# Altium schematic sheet SAMV71_Xplained_Ultra_TopLevel.SchDoc: Top Level Schematics
size A3; Organization: ATMEL Norway; Address1: Vestre Rosten 79; Address2: N-7075 TILLER; Address3: NORWAY; DocumentNumber: A09-2407; Revision: 11; SheetNumber: 1; SheetTotal: 13; DrawnBy: Microchip Norway; Engineer: AH; PageSetup: Record=PageOptions|CenterHorizontal=True|CenterVertical=True|PrintScale=1.01|XCorrection=1.00|YCorrection=1.00|PrintKind=1|BorderSize=5000000|LeftOffset=0|BottomOffset=0|Orientation=2|PaperLength=1000|PaperWidth=1000|Scale=100|PaperSource=7|PrintQuality=-4|MediaType=1|DitherType=10|PaperKind=Letter|PrintScaleMode=1; ProjectTitle: SAM V71 Xplained Ultra; PCBNumber: A08-2216; PCBRevision: 4
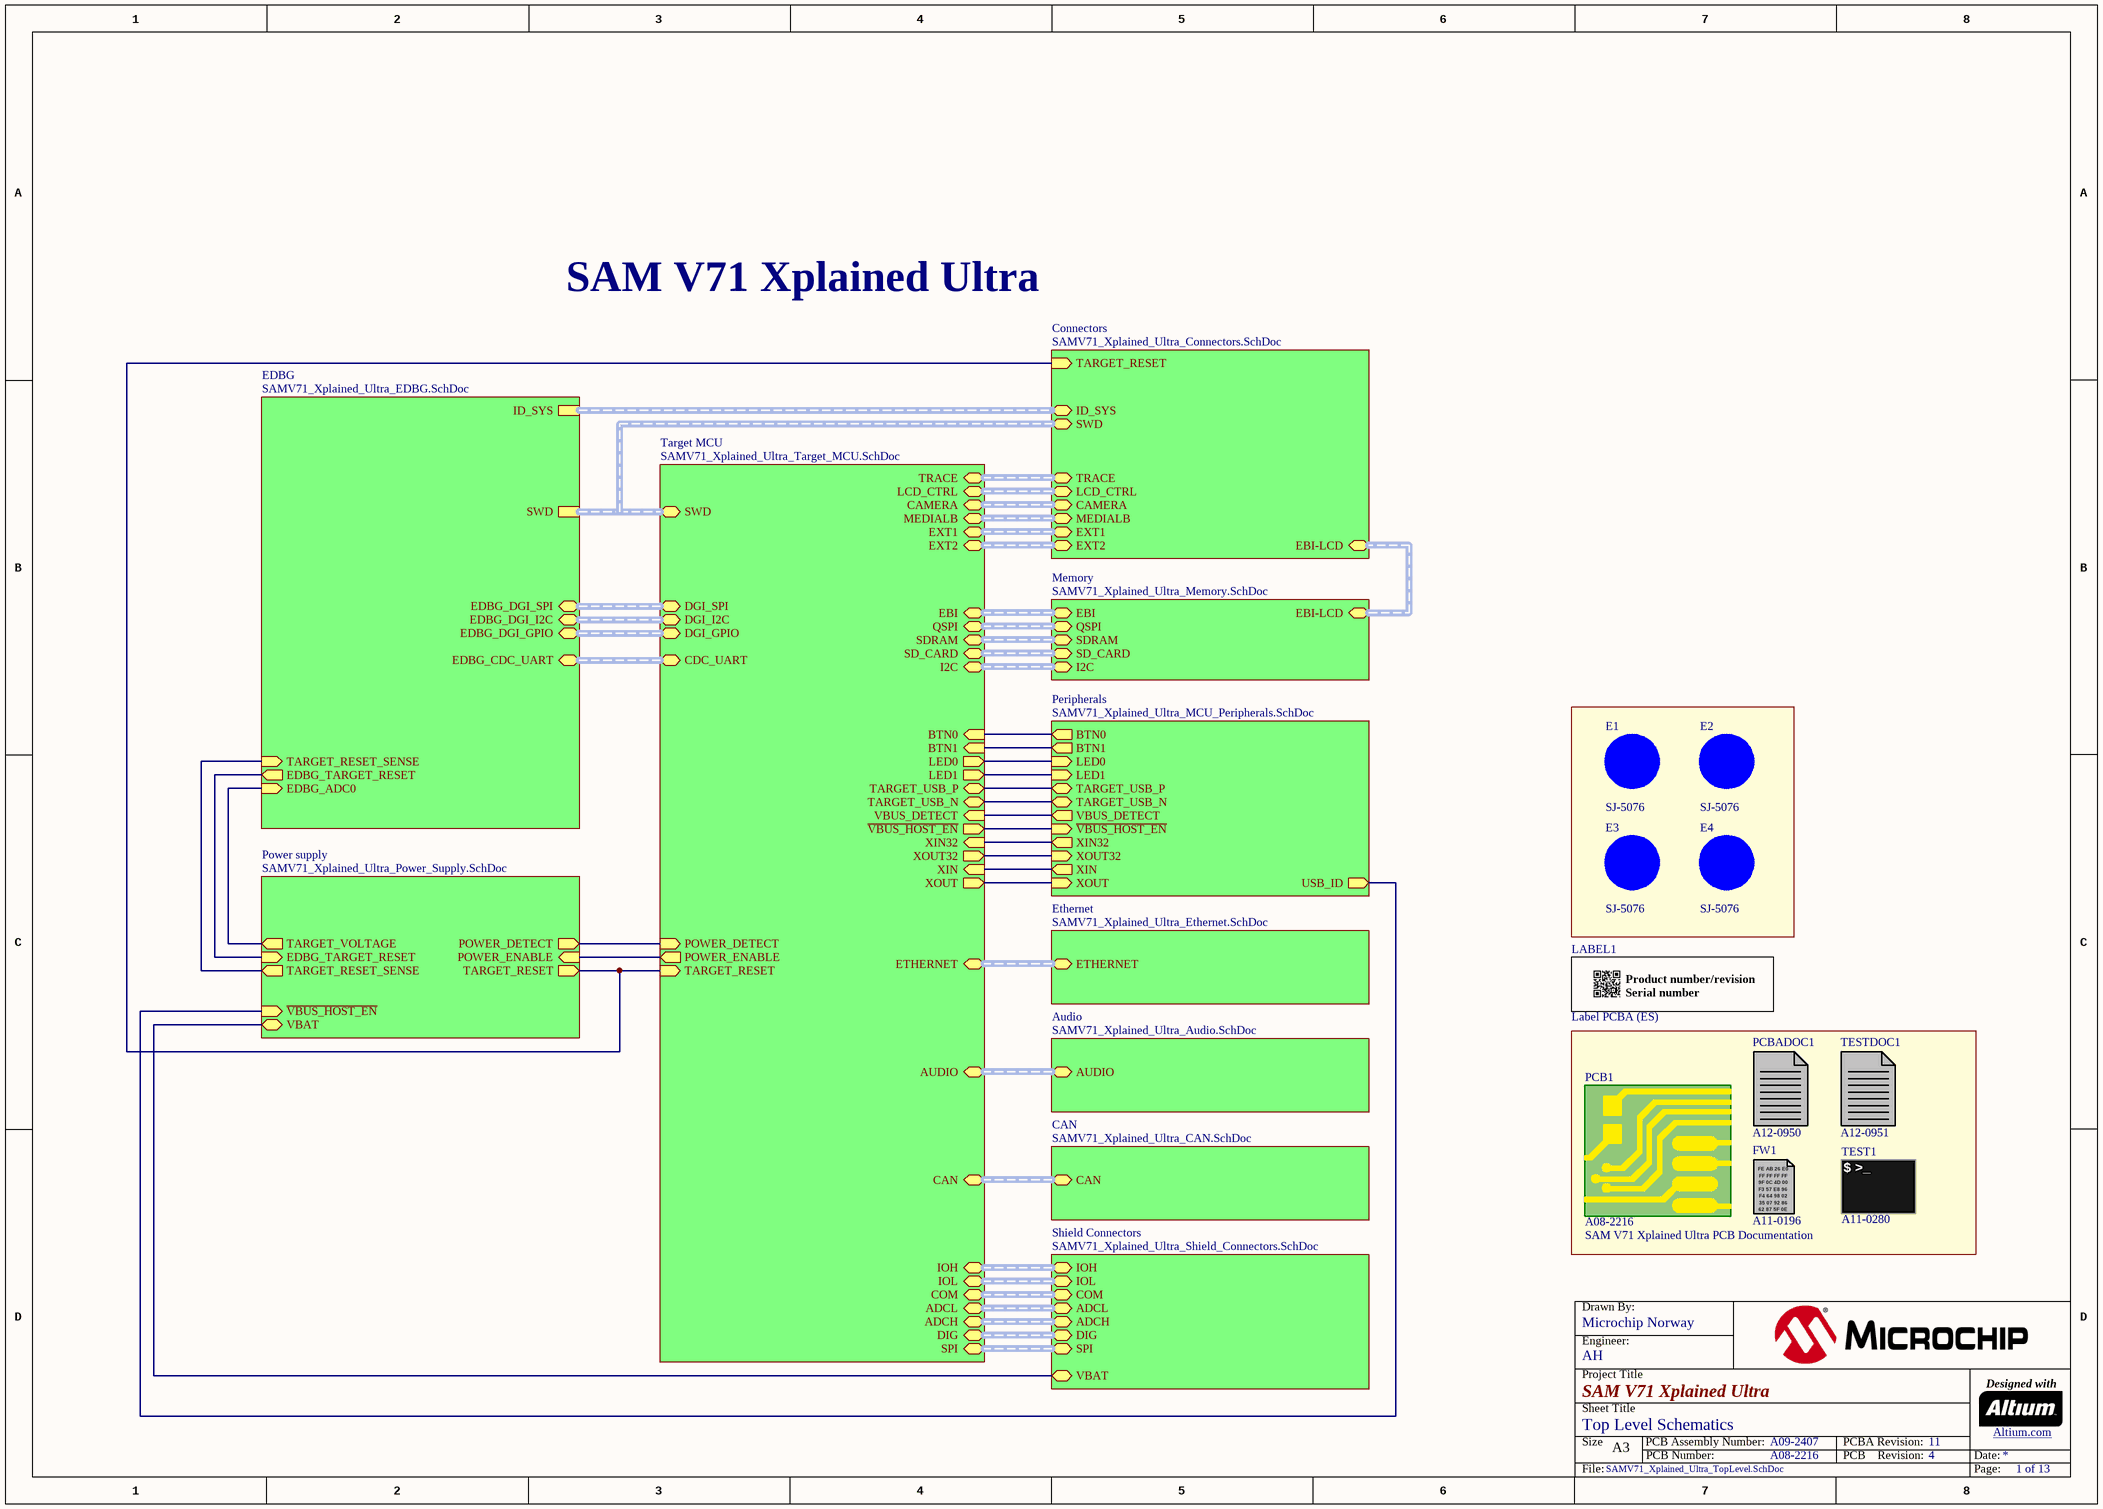
[diagram p0: SAMV71_Xplained_Ultra_TopLevel.SchDoc]

## Parts
E1  value SJ-5076  [AP8-00192]
E2  value SJ-5076  [AP8-00192]
E3  value SJ-5076  [AP8-00192]
E4  value SJ-5076  [AP8-00192]
FW1  AN: A11-0196  (mechanical)
LABEL1  value Label PCBA (ES)  [AP8-00317]
PCB1  value SAM V71 Xplained Ultra PCB Documentation  AN: A08-2216  (mechanical)
PCBADOC1  AN: A12-0950  (mechanical)
TEST1  AN: A11-0280  (mechanical)
TESTDOC1  AN: A12-0951  (mechanical)

## Sub-sheets
Audio = SAMV71_Xplained_Ultra_Audio.SchDoc: AUDIO (harness AUDIO)
CAN = SAMV71_Xplained_Ultra_CAN.SchDoc: CAN (harness CAN)
Connectors = SAMV71_Xplained_Ultra_Connectors.SchDoc: ID_SYS (harness ID_SYS), EXT1 (harness EXT1), EXT2 (harness EXT2), CAMERA (harness CAMERA), MEDIALB (harness MEDIALB), TRACE (harness TRACE), LCD_CTRL (harness LCD_CTRL), SWD (harness SWD), TARGET_RESET (in), EBI-LCD (harness EBI-LCD)
EDBG = SAMV71_Xplained_Ultra_EDBG.SchDoc: ID_SYS (harness ID_SYS), SWD (harness SWD), EDBG_CDC_UART (harness CDC_UART), EDBG_DGI_I2C (harness DGI_I2C), EDBG_DGI_SPI (harness DGI_SPI), EDBG_DGI_GPIO (harness DGI_GPIO), TARGET_RESET_SENSE (in), EDBG_ADC0 (in), EDBG_TARGET_RESET (out)
Ethernet = SAMV71_Xplained_Ultra_Ethernet.SchDoc: ETHERNET (harness ETHERNET)
Memory = SAMV71_Xplained_Ultra_Memory.SchDoc: SD_CARD (harness SD_CARD), EBI (harness EBI), QSPI (harness QSPI), SDRAM (harness SDRAM), I2C (harness I2C), EBI-LCD (harness EBI-LCD)
Peripherals = SAMV71_Xplained_Ultra_MCU_Peripherals.SchDoc: BTN0 (out), BTN1 (out), LED0 (in), TARGET_USB_N (bidir), TARGET_USB_P (bidir), XOUT32 (in), XIN32 (out), XIN (out), XOUT (in), LED1 (in), VBUS_DETECT (out), USB_ID (out), ~{VBUS_HOST_EN} (in)
Power supply = SAMV71_Xplained_Ultra_Power_Supply.SchDoc: TARGET_VOLTAGE (out), ~{VBUS_HOST_EN} (in), EDBG_TARGET_RESET (in), POWER_ENABLE (in), TARGET_RESET (out), POWER_DETECT (out), VBAT (bidir), TARGET_RESET_SENSE (out)
Shield Connectors = SAMV71_Xplained_Ultra_Shield_Connectors.SchDoc: IOH (harness IOH), IOL (harness IOL), COM (harness COM), ADCL (harness ADCL), ADCH (harness ADCH), DIG (harness DIG), SPI (harness SPI), VBAT (bidir)
Target MCU = SAMV71_Xplained_Ultra_Target_MCU.SchDoc: SWD (harness SWD), DGI_SPI (harness DGI_SPI), DGI_I2C (harness DGI_I2C), DGI_GPIO (harness DGI_GPIO), CDC_UART (harness CDC_UART), SD_CARD (harness SD_CARD), QSPI (harness QSPI), SDRAM (harness SDRAM), ETHERNET (harness ETHERNET), EXT2 (harness EXT2), EXT1 (harness EXT1), EBI (harness EBI), CAMERA (harness CAMERA), AUDIO (harness AUDIO), BTN0 (in), BTN1 (in), LED0 (out), TARGET_USB_P (bidir), XOUT32 (out), XIN32 (in), XIN (in), XOUT (out), LED1 (out), TARGET_USB_N (bidir), IOH (harness IOH), IOL (harness IOL), COM (harness COM), ADCL (harness ADCL), ADCH (harness ADCH), DIG (harness DIG), CAN (harness CAN), ~{VBUS_HOST_EN} (out), I2C (harness I2C), TARGET_RESET (in), POWER_ENABLE (out), TRACE (harness TRACE), LCD_CTRL (harness LCD_CTRL), MEDIALB (harness MEDIALB), SPI (harness SPI), POWER_DETECT (in), VBUS_DETECT (in)

## Nets
(unnamed): sheet Target MCU/BTN0, sheet Peripherals/BTN0
(unnamed): sheet Target MCU/BTN1, sheet Peripherals/BTN1
(unnamed): sheet Target MCU/LED0, sheet Peripherals/LED0
(unnamed): sheet Target MCU/TARGET_USB_P, sheet Peripherals/TARGET_USB_P
(unnamed): sheet Target MCU/XOUT32, sheet Peripherals/XOUT32
(unnamed): sheet Target MCU/XIN32, sheet Peripherals/XIN32
(unnamed): sheet Target MCU/XIN, sheet Peripherals/XIN
(unnamed): sheet Target MCU/XOUT, sheet Peripherals/XOUT
(unnamed): sheet Target MCU/LED1, sheet Peripherals/LED1
(unnamed): sheet Target MCU/TARGET_USB_N, sheet Peripherals/TARGET_USB_N
(unnamed): sheet Target MCU/~{VBUS_HOST_EN}, sheet Peripherals/~{VBUS_HOST_EN}
(unnamed): sheet Target MCU/TARGET_RESET, sheet Connectors/TARGET_RESET, sheet Power supply/TARGET_RESET
(unnamed): sheet Target MCU/POWER_ENABLE, sheet Power supply/POWER_ENABLE
(unnamed): sheet Target MCU/POWER_DETECT, sheet Power supply/POWER_DETECT
(unnamed): sheet Target MCU/VBUS_DETECT, sheet Peripherals/VBUS_DETECT
(unnamed): sheet EDBG/TARGET_RESET_SENSE, sheet Power supply/TARGET_RESET_SENSE
(unnamed): sheet EDBG/EDBG_ADC0, sheet Power supply/TARGET_VOLTAGE
(unnamed): sheet EDBG/EDBG_TARGET_RESET, sheet Power supply/EDBG_TARGET_RESET
(unnamed): sheet Power supply/~{VBUS_HOST_EN}, sheet Peripherals/USB_ID
(unnamed): sheet Power supply/VBAT, sheet Shield Connectors/VBAT

Not connected (* = marked no-connect by the designer): E1 1(FIDUCIAL); E2 1(FIDUCIAL); E3 1(FIDUCIAL); E4 1(FIDUCIAL)

## Buses and harness runs
harness sheet Audio/AUDIO = sheet Target MCU/AUDIO
harness sheet CAN/CAN = sheet Target MCU/CAN
harness sheet Connectors/CAMERA = sheet Target MCU/CAMERA
harness sheet Connectors/EBI-LCD = sheet Memory/EBI-LCD
harness sheet Connectors/EXT1 = sheet Target MCU/EXT1
harness sheet Connectors/EXT2 = sheet Target MCU/EXT2
harness sheet Connectors/ID_SYS = sheet EDBG/ID_SYS
harness sheet Connectors/LCD_CTRL = sheet Target MCU/LCD_CTRL
harness sheet Connectors/MEDIALB = sheet Target MCU/MEDIALB
harness sheet Connectors/SWD = sheet EDBG/SWD = sheet Target MCU/SWD
harness sheet Connectors/TRACE = sheet Target MCU/TRACE
harness sheet EDBG/EDBG_CDC_UART = sheet Target MCU/CDC_UART
harness sheet EDBG/EDBG_DGI_GPIO = sheet Target MCU/DGI_GPIO
harness sheet EDBG/EDBG_DGI_I2C = sheet Target MCU/DGI_I2C
harness sheet EDBG/EDBG_DGI_SPI = sheet Target MCU/DGI_SPI
harness sheet Ethernet/ETHERNET = sheet Target MCU/ETHERNET
harness sheet Memory/EBI = sheet Target MCU/EBI
harness sheet Memory/I2C = sheet Target MCU/I2C
harness sheet Memory/QSPI = sheet Target MCU/QSPI
harness sheet Memory/SD_CARD = sheet Target MCU/SD_CARD
harness sheet Memory/SDRAM = sheet Target MCU/SDRAM
harness sheet Shield Connectors/ADCH = sheet Target MCU/ADCH
harness sheet Shield Connectors/ADCL = sheet Target MCU/ADCL
harness sheet Shield Connectors/COM = sheet Target MCU/COM
harness sheet Shield Connectors/DIG = sheet Target MCU/DIG
harness sheet Shield Connectors/IOH = sheet Target MCU/IOH
harness sheet Shield Connectors/IOL = sheet Target MCU/IOL
harness sheet Shield Connectors/SPI = sheet Target MCU/SPI

## Notes on the sheet
- SAM V71 Xplained Ultra
- Drawn By:
- Project Title
- Engineer:
- Designed with
- Sheet Title
- Size
- A3
- PCB Number:
- PCB Assembly Number:
- PCBA Revision:
- PCB    Revision:
- Date:
- Altium.com <http://go.altium.com/MicrochipLandingPage_Evaluation.html>
- File:
- Page:
- (in symbol A08-1623) / Product number/revision / Serial number
- (in symbol A11-0196) FE AB 26 E0; FF FF FF FF; 9F 0C 4D 00; F3 57 E8 96; F4 64 98 02; 35 07 92 86; 62 87 5F 0E
- (in symbol A11-0280) $ >_

## Library data of the parts
E1-E4 = A08-0053: 2.8mm adhesive feet,diam 8.0mm; PartGroup: Mechanical devices,Mounting accessories; Manufacturer: 3M; Status: Active; AN: A08-0053; Height: 2,79999995231628; MPN: SJ-5076
FW1 = A11-0196: EDBG secured firmware; PartGroup: Software,Firmware,Tools; Manufacturer: ATMEL; Value: EDBG secured firmware
LABEL1 = A08-1623: PCBA Label for board with ES device; PartGroup: Mechanical devices,Packaging materials,Printed Labels; Manufacturer: ACT Logimark AS; MPN: 505462; Status: New; AN: A08-1623
PCB1 = A08-2216: SAMV7 Xplained Ultra PCB Documentation; PartGroup: Mechanical devices,Printed circuit boards
PCBADOC1 = A12-0950: SAMV7 Xplained pro PCBA Documentation; PartGroup: Documentation,PCBA Documents,Atmel; Value: SAM V71 Xplained pro PCBA Documentation
TEST1 = A11-0280: Fixture eggTest for SAMV7 Xplained Ultra; PartGroup: Software,Test software,Starter Kit; Value: SAM V71 Xplained Ultra Test
TESTDOC1 = A12-0951: SAMV7 Xplained Pro Test Instructions; PartGroup: Documentation,Procedures,Test Instructions; Value: SAM V71 Xplained Pro Test Instructions